# EasyEDA Pro project JLCEDA_AT-START-F490 V1.0.epro, board AT-START-F490 V1.0
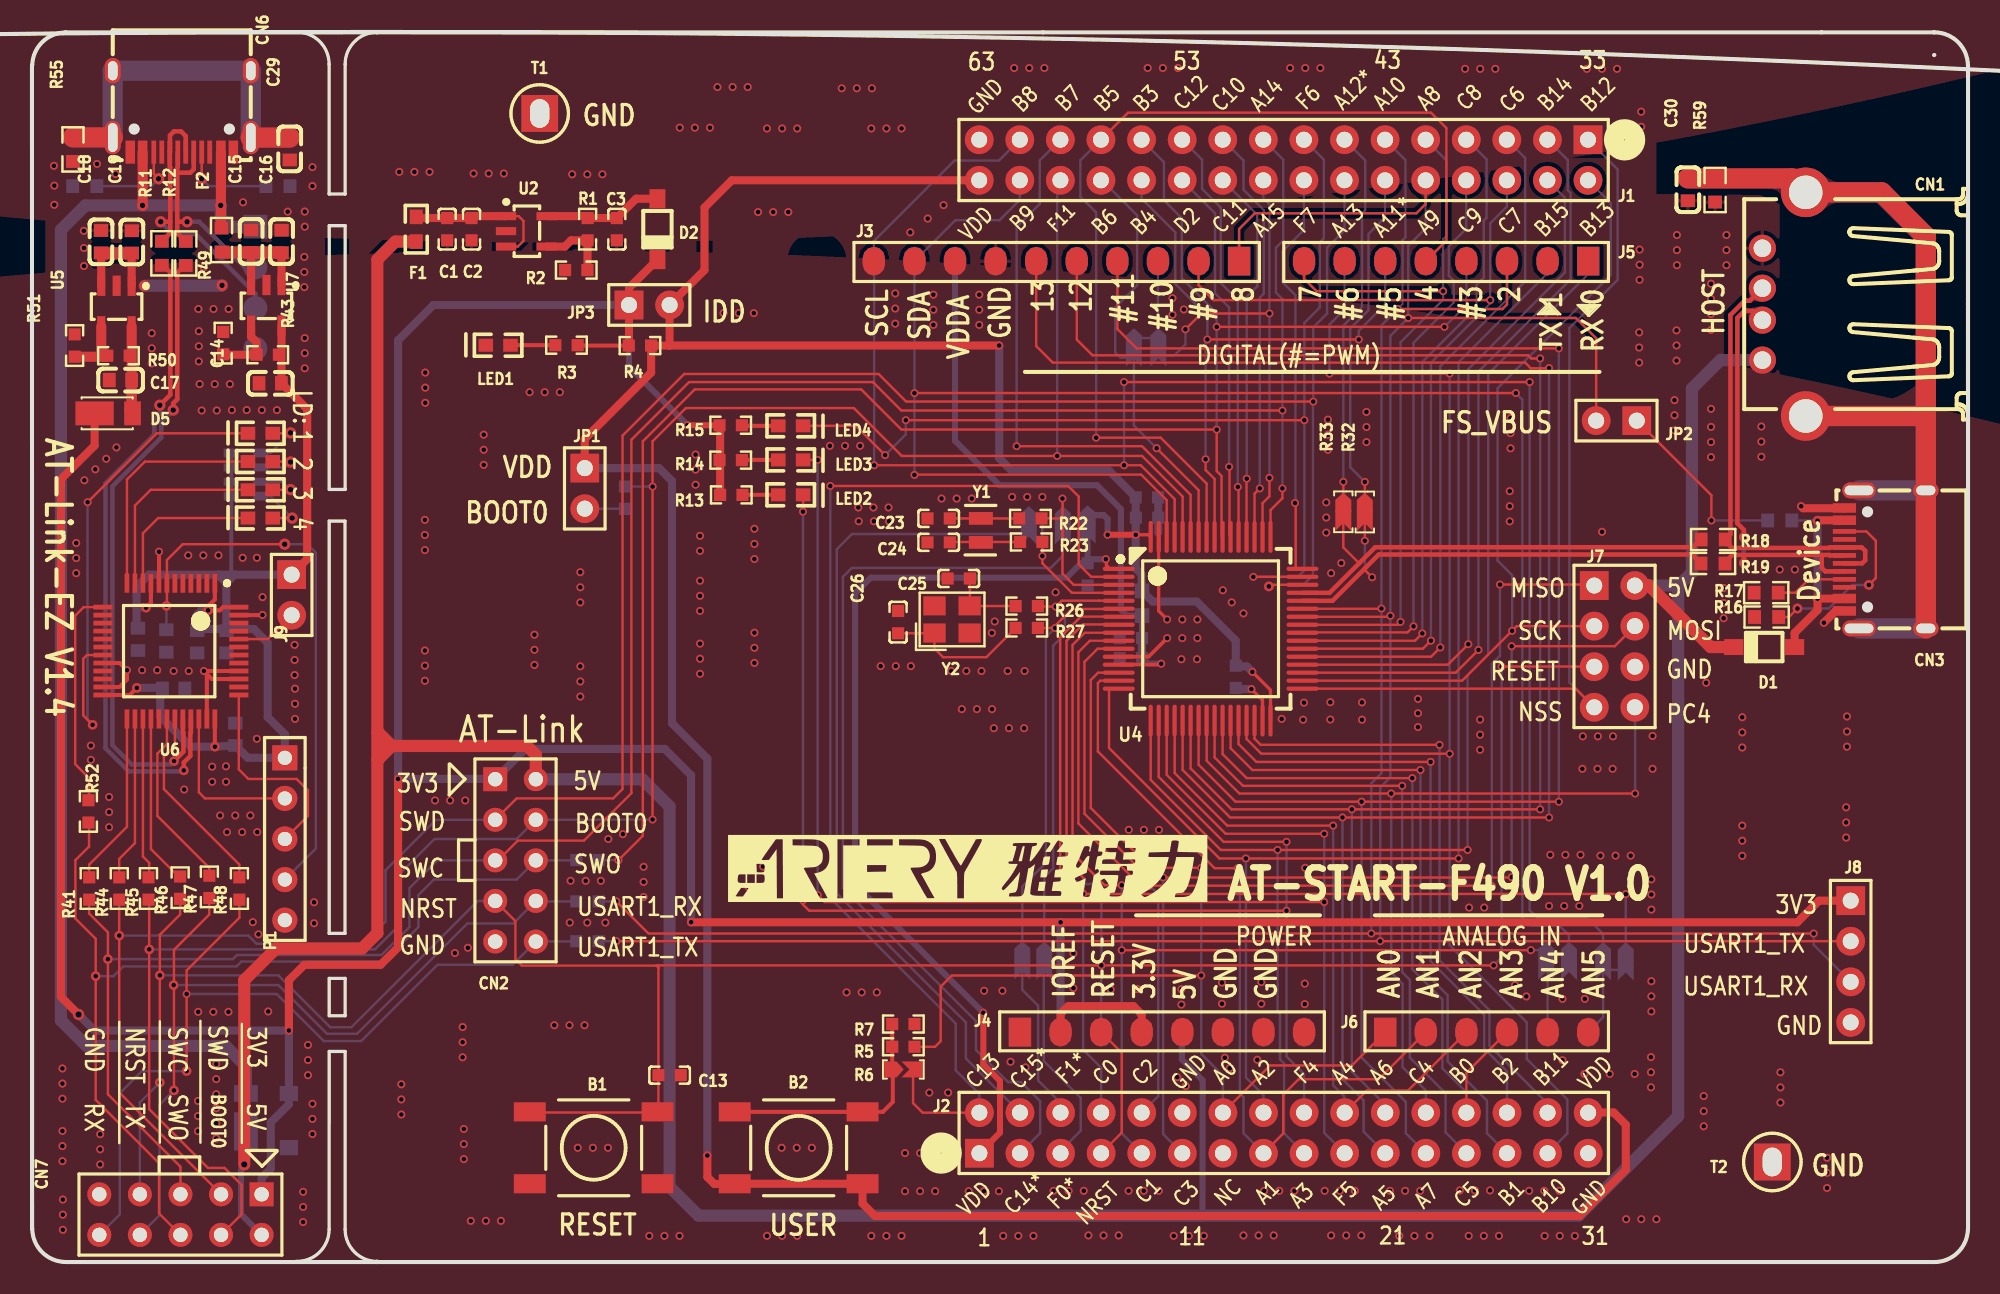
[diagram p4: board, top side]
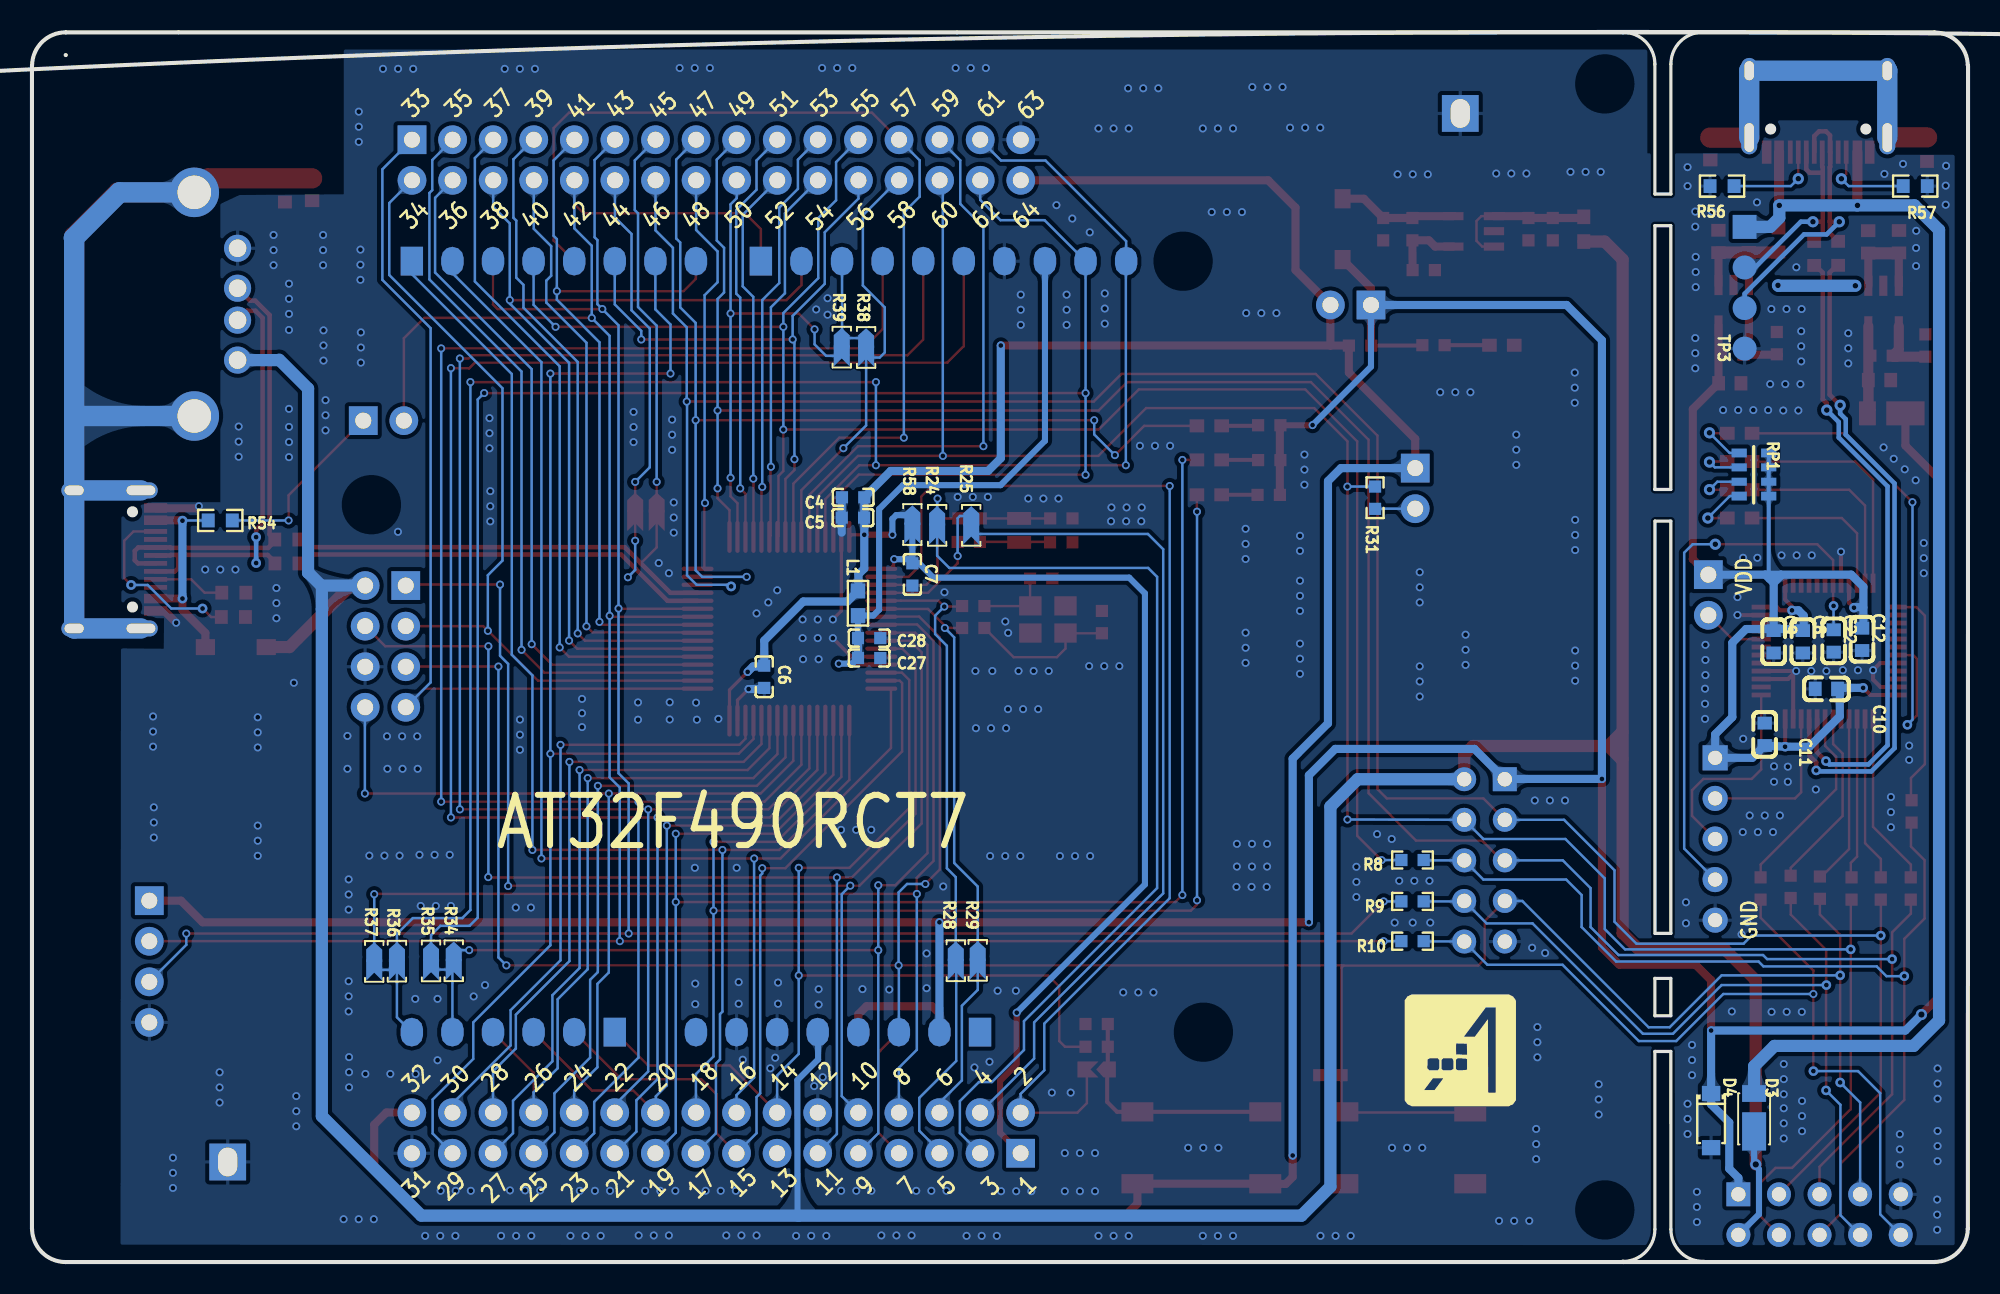
[diagram p5: board, bottom side, seen from below]

Outline 121.17 x 77 mm; copper layers: Top Layer, Bottom Layer. Coordinates in mm from the lower left corner of the outline.
Outline path: 16.6,76.99 arc(18.01,76.4) 18.6,74.99 18.6,66.85 19.6,66.85 19.6,74.98 arc(20.19,76.39) 21.6,76.98 ; 16.52,0.04 arc(17.98,0.6) 18.6,2.04 18.6,13.18 19.6,13.18 19.6,2.04 arc(20.19,0.63) 21.6,0.03 arc(21.59,0.03) 21.58,0.03 ; 119.04,75.55 arc(119.05,75.55) 119.06,75.55 ; 0,74.87 0.01,2.11 arc(0.01,2.09) 0.02,2.07 arc(0.63,0.62) 2.09,0.01 arc(2.1,0) 2.12,0 21.57,0 arc(21.58,0) 21.58,0 21.6,0 104.94,0 119.06,0 arc(120.53,0.6) 121.16,2.07 arc(121.17,2.08) 121.17,2.1 121.17,2.1 121.17,74.87 arc(121.17,74.89) 121.16,74.91 arc(120.53,76.37) 119.06,76.97 119.04,76.97 2.12,76.97 arc(2.1,76.97) 2.08,76.97 arc(0.64,76.36) 0.02,74.93 arc(0,74.9) 0,74.87 ; 18.6,17.76 18.6,15.42 19.6,15.42 19.6,17.76 18.6,17.76 ; 18.6,20.57 19.59,20.57 19.59,46.38 18.6,46.38 18.6,20.57 ; 18.6,64.87 18.6,48.36 19.59,48.36 19.6,48.37 19.6,64.87 18.6,64.87
Stack: Top Layer 0.035mm / Dielectric1 1.51mm FR4 er 4.5 / Bottom Layer 0.035mm

## Design rules (mm)
net M-USB_D+: LK
net M-USB_D-: LK
net USB-: LKD
net USB+: LKD
net PA12: DP1
net PA11: DP1
net FD-: FS
net FD+: FS
spacing Default (default): track to track 0.152, other pairs 0.127 to 0.3
track width Default (default): min 0.15, default 0.15, max 25.4
differential pair differentialPair (default): width min 0.152, default 0.282, max 2.54; gap min 0.152, default 0.152
via Default (default): diameter min 0.5, default 0.5, max 10; hole min 0.201, default 0.305, max 5.999
net GND uses gge24930(1)

## Placement (name value [footprint] x y rotation side)
B1  BUTTON_SMT,6.0x6.0x4.5mm  [BUTTON_SMT_6*6*5]  35.16 7.15 0 top
B2  BUTTON_SMT,6.0x6.0x4.5mm  [BUTTON_SMT_6*6*5]  47.98 7.15 180 top
C1  10uF  [0603_C-M]  25.99 64.65 90 top
C2  0.1uF  [0603_C-M]  27.51 64.65 90 top
C3  10uF  [0603_C-M]  36.6 64.65 90 top
C4  4.7uF  [0603_C-M]  69.78 47.87 180 bottom
C5  0.1uF  [0603_C-M]  69.79 46.6 180 bottom
C6  0.1uF  [0603_C-M]  75.34 36.64 90 bottom
C7  0.1uF  [0603_C-M]  66.07 43.04 90 bottom
C8  4.7uF  [C0603]  10.34 38.83 270 bottom
C9  100nF  [C0603]  12.17 38.83 270 bottom
C10  100nF  [C0603]  8.87 35.88 0 bottom
C11  100nF  [C0603]  12.73 33.03 90 bottom
C12  100nF  [C0603]  6.63 38.98 270 bottom
C13  0.1uF  [0603_C-M]  39.91 11.7 0 top
C14  10uF  [C0603]  14.91 55.01 180 top
C15  10uF  [C0603]  13.72 63.9 90 top
C16  100nF  [C0603]  15.62 63.88 90 top
C17  10uF  [C0603]  5.54 55.21 180 top
C18  10uF  [C0603]  4.32 63.87 90 top
C19  100nF  [C0603]  6.25 63.86 90 top
C22  100nF  [C0603]  8.41 38.88 270 bottom
C23  18pF  [0603_C-M]  56.75 46.55 180 top
C24  18pF  [0603_C-M]  56.75 45.05 180 top
C25  15pF  [0603_C-M]  58 42.79 180 top
C26  15pF  [0603_C-M]  54.21 40.06 90 top
C27  1uF  [0603_C-M]  68.77 37.81 180 bottom
C28  0.1uF  [0603_C-M]  68.77 39.05 180 bottom
C29  100nF  [C0603]  16.13 69.69 90 top
C30  100nF  [C0603]  103.63 67.13 90 top
CN1  USB type A  [USB-A-TH__USB-AF-90]  109.65 59.96 90 top
CN2  NC(Header 2x5)  [HDR2X5#2]  28.99 30.22 270 top
CN3  -  [USB-C-SMD_TYPEC-304-BCP16]  115.98 43.98 90 top
CN6  -  [USB-C-SMD_TYPEC-304-BCP16]  9.38 72.02 180 top
CN7  CON1  [HDR2X5]  14.37 4.24 180 top
D1  DFLS130L-7  [SOD-123]  108.41 38.5 0 top
D2  DFLS130L-7  [SOD-123]  39.14 64.65 90 top
D3  DFLS130L-7  [POWERDI-123_L2.8-W1.8-LS3.7-RD]  13.39 9.36 90 bottom
D4  SMF3.3A  [SOD-123_L2.8-W1.8-LS3.7-RD]  16.08 8.85 270 bottom
D5  DFLS130L-7  [POWERDI-123_L2.8-W1.8-LS3.7-RD]  5.11 53.13 0 top
F1  SMD0603B050TF  [R0603#2]  24.06 63.88 90 top
F2  SMD0603B050TF  [R0603]  11.86 63.97 270 top
J1  Header 2x16  [HDR-M-2.54_2X16]  78.33 68.98 180 top
J2  Header 2x16  [HDR-M-2.54_2X16]  78.34 8.08 0 top
J3  CON10  [FEMALE HEADER 1X10]  75.55 62.65 180 top
J4  CON8  [FEMALE HEADER 1X8]  61.83 14.39 0 top
J5  CON8  [FEMALE HEADER 1X8]  97.39 62.65 180 top
J6  CON6  [FEMALE HEADER 1X6]  84.69 14.39 0 top
J7  Header 4X2  [HDR2X4]  97.77 42.35 270 top
J8  Header 1x4  [HDR1X4]  113.82 22.62 270 top
J9  1X2P,Male,DIP_2.54  [HDR1X2]  16.25 43.03 270 top
JP1  NC(Header 1x2)  [HEADER 1X2]  34.6 49.7 270 top
JP2  NC(Header 1x2)  [HEADER 1X2]  100.43 52.67 180 top
JP3  NC(Header 1x2)  [HEADER 1X2]  37.37 59.91 0 top
L1  0.5A,600R@100Mhz  [0603_L]  69.47 41.24 270 bottom
LD1  RED  [LED0603]  15.06 46.58 180 top
LD2  GREEN  [LED0603]  15.06 48.35 180 top
LD3  BLUE  [LED0603]  15.06 50.11 180 top
LD4  YELLOW  [LED0603]  15.06 51.88 180 top
LED1  RED  [LED0603]  29.95 57.39 180 top
LED2  RED  [LED0603]  46.71 48.02 0 top
LED3  YELLOW  [LED0603]  46.71 50.21 0 top
LED4  GREEN  [LED0603]  46.71 52.34 0 top
P1  HDR-M-2.54_1x5  [HDR-M-2.54_1X5]  15.83 26.48 270 top
R1  51k  [0603_R-M]  34.78 64.65 270 top
R2  15k  [0603_R-M]  34.06 62.09 180 top
R3  1K  [0603_R-M]  33.45 57.39 0 top
R4  0R  [0603_R-M]  38.05 57.37 0 top
R5  0R  [0603_R-M]  54.54 13.48 0 top
R6  NC  [SB-PAD]  54.54 12.05 0 top
R7  100K  [0603_R-M]  54.54 14.9 180 top
R8  470R  [0603_R-M]  34.77 25.17 0 bottom
R9  470R  [0603_R-M]  34.77 22.58 0 bottom
R10  470R  [0603_R-M]  34.77 20.09 0 bottom
R11  0Ω  [R0603]  8.13 63.14 270 top
R12  0Ω  [R0603]  9.63 63.13 270 top
R13  1K  [0603_R-M]  43.77 48.02 0 top
R14  1K  [0603_R-M]  43.73 50.2 0 top
R15  1K  [0603_R-M]  43.73 52.38 0 top
R16  5.1kΩ  [R0603]  108.56 40.38 180 top
R17  5.1kΩ  [R0603]  108.54 41.9 180 top
R18  0Ω  [R0603]  105.22 45.23 0 top
R19  0Ω  [R0603]  105.21 43.73 0 top
R22  0R  [0603_R-M]  62.49 46.55 0 top
R23  0R  [0603_R-M]  62.54 45.07 0 top
R24  NC  [SB-PAD]  64.52 46.12 270 bottom
R25  NC  [SB-PAD]  62.38 46.12 270 bottom
R26  0R  [0603_R-M]  62.26 41.06 0 top
R27  0R  [0603_R-M]  62.26 39.69 0 top
R28  NC  [SB-PAD]  63.35 18.86 270 bottom
R29  NC  [SB-PAD]  61.98 18.89 270 bottom
R31  10K  [0603_R-M]  37.11 47.84 270 bottom
R32  NC  [SB-PAD]  83.42 46.95 270 top
R33  NC  [SB-PAD]  82.07 46.96 270 top
R34  0R  [SB-PAD]  94.77 18.86 270 bottom
R35  NC  [SB-PAD]  96.19 18.85 270 bottom
R36  NC  [SB-PAD]  98.33 18.83 270 bottom
R37  0R  [SB-PAD]  99.75 18.82 270 bottom
R38  NC  [SB-PAD]  68.96 57.25 270 bottom
R39  0R  [SB-PAD]  70.49 57.27 270 bottom
R41  33R  [0603_R-M]  3.58 23.38 270 top
R43  47K  [0603_R-M]  14.76 56.8 180 top
R44  33R  [0603_R-M]  5.46 23.38 270 top
R45  33R  [0603_R-M]  7.29 23.38 270 top
R46  33R  [0603_R-M]  9.27 23.43 270 top
R47  33R  [0603_R-M]  11.1 23.48 270 top
R48  33R  [0603_R-M]  12.98 23.38 270 top
R49  15K  [0603_R-M]  11.97 57.52 270 top
R50  51K  [0603_R-M]  5.41 56.73 180 top
R51  15K  [0603_R-M]  2.67 57.37 270 top
R52  33R  [0603_R-M]  3.53 28.21 270 top
R54  10kΩ  [R0603]  109.38 46.42 0 bottom
R55  1MΩ  [R0603]  2.57 69.64 270 top
R56  5.1kΩ  [R0603]  15.39 67.35 0 bottom
R57  5.1kΩ  [R0603]  3.3 67.35 180 bottom
R58  0R  [SB-PAD]  66.07 46.17 270 bottom
R59  1MΩ  [R0603]  105.34 67.1 270 top
RP1  1K  [0603*4,8P4R]  12.47 47.94 90 bottom
T1  Testpoint  [TESTHOOK]  31.78 71.9 270 top
T2  Testpoint  [TESTHOOK]  108.92 6.26 90 top
TP3  1X4P_2.54F  [HDR1X4 - TOP]  13.98 64.8 90 bottom
U2  RT9080N-08GJ5  [SOT-23-5]  31.32 62.93 0 top
U4  -  [lqfp-64_l10.0-w10.0-p0.50-ls12.0-bl]  73.76 39.64 270 top
U5  RT9080N-08GJ5  [SOT-23-5]  3.7 59.46 270 top
U6  AT32F403CGT6  [LQFP48 - 2]  11.45 42.5 270 top
U7  RT9080N-08GJ5  [SOT-23-5]  13.08 59.51 270 top
Y1  32.768KHz  [XTAL_SOP - FC-12M]  59.39 46.55 270 top
Y2  12MHz  [CRYSTAL-SMD_4P-L3.2-W2.5-BL]  57.58 40.22 0 top

## Footprints (pads in the part's own frame, mm; a bottom-side part is the same pattern mirrored in y, then rotated)
0603*4,8P4R
  rect 0.55x0.95 smd: 1(0,0) 4(2.7,0) 5(2.7,1.85) 8(0,1.85)
  rect 0.5x0.95 smd: 2(0.9,0) 3(1.8,0) 6(1.8,1.85) 7(0.9,1.85)
0603_C-M
  rect 0.762x0.762 smd: 1(0.699,0) 2(-0.699,0)
0603_L
  rect 0.93x0.9 smd: 1(-0.77,0) 2(0.77,0)
0603_R-M
  rect 0.762x0.762 smd: 1(0.699,0) 2(-0.699,0)
BUTTON_SMT_6*6*5
  rect 2x1.2 smd: 1(-4,2.25) 2(4,2.25) 3(-4,-2.25) 4(4,-2.25)
C0603
  rect 0.8x0.9 smd: 1(-0.7,0) 2(0.7,0)
CRYSTAL-SMD_4P-L3.2-W2.5-BL
  rect 1.4x1.2 smd: 1(-1.1,-0.85) 2(1.1,-0.85) 3(1.1,0.85) 4(-1.1,0.85)
FEMALE HEADER 1X6
  custom 1.4x1.8 hole 0.7x1: 1(0,0) 2(2.54,0) 3(5.08,0) 4(7.62,0) 5(10.16,0) 6(12.7,0)
FEMALE HEADER 1X8
  custom 1.4x1.8 hole 0.7x1: 1(0,0) 2(2.54,0) 3(5.08,0) 4(7.62,0) 5(10.16,0) 6(12.7,0) 7(15.24,0) 8(17.78,0)
FEMALE HEADER 1X10
  custom 1.4x1.8 hole 0.7x1: 1(0,0) 2(2.54,0) 3(5.08,0) 4(7.62,0) 5(10.16,0) 6(12.7,0) 7(15.24,0) 8(17.78,0) 9(20.32,0) 10(22.86,0)
HDR1X2
  rect 1.8x1.8 hole 1.005x1: 1(0,0)
  round 1.8 hole 1.005x1: 2(2.54,0)
HDR1X4
  rect 1.8x1.8 hole 1: 1(0,0)
  round 1.8 hole 1: 2(2.54,0) 3(5.08,0) 4(7.62,0)
HDR1X4 - TOP
  rect 1.5x1.5 smd: 1(0,0)
  round 1.5 smd: 2(-2.54,0) 3(-5.08,0) 4(-7.62,0)
HDR2X4
  rect 1.8x1.8 hole 1: 1(0,0)
  round 1.8 hole 1: 2(0,2.54) 3(2.54,0) 4(2.54,2.54) 5(5.08,0) 6(5.08,2.54) 7(7.62,0) 8(7.62,2.54)
HDR2X5
  rect 1.5x1.5 hole 0.9: 1(0,0)
  round 1.5 hole 0.9: 2(0,2.54) 3(2.54,0) 4(2.54,2.54) 5(5.08,0) 6(5.08,2.54) 7(7.62,0) 8(7.62,2.54) 9(10.16,0) 10(10.16,2.54)
HDR2X5#2
  rect 1.5x1.5 hole 0.905x0.9: 1(0,0)
  round 1.5 hole 0.905x0.9: 2(0,2.54) 3(2.54,0) 4(2.54,2.54) 5(5.08,0) 6(5.08,2.54) 7(7.62,0) 8(7.62,2.54) 9(10.16,0) 10(10.16,2.54)
HDR-M-2.54_1X5
  rect 1.575x1.575 hole 0.889: 1(-5.08,0)
  round 1.575 hole 0.889: 2(-2.54,0) 3(0,0) 4(2.54,0) 5(5.08,0)
HDR-M-2.54_2X16
  rect 1.8x1.8 hole 1: 1(-19.05,-1.27)
  round 1.8 hole 1: 2(-19.05,1.27) 3(-16.51,-1.27) 4(-16.51,1.27) 5(-13.97,-1.27) 6(-13.97,1.27) 7(-11.43,-1.27) 8(-11.43,1.27) 9(-8.89,-1.27) 10(-8.89,1.27) 11(-6.35,-1.27) 12(-6.35,1.27) 13(-3.81,-1.27) 14(-3.81,1.27) 15(-1.27,-1.27) 16(-1.27,1.27) 17(1.27,-1.27) 18(1.27,1.27) 19(3.81,-1.27) 20(3.81,1.27) 21(6.35,-1.27) 22(6.35,1.27) 23(8.89,-1.27) 24(8.89,1.27) 25(11.43,-1.27) 26(11.43,1.27) 27(13.97,-1.27) 28(13.97,1.27) 29(16.51,-1.27) 30(16.51,1.27) 31(19.05,-1.27) 32(19.05,1.27)
HEADER 1X2
  rect 1.8x1.8 hole 1.005x1: 1(0,-0.001)
  round 1.8 hole 1.005x1: 2(2.54,0)
LED0603
  rect 0.914x0.813 smd: 1(-0.001,0.005) 2(1.548,0.005)
LQFP48 - 2
  rect 1.2x0.3 smd: 1(0,0) 2(0,-0.5) 3(0,-1) 4(0,-1.5) 5(0,-2) 6(0,-2.5) 7(0,-3) 8(0,-3.5) 9(0,-4) 10(0,-4.5) 11(0,-5) 12(0,-5.5) 25(8.5,-5.5) 26(8.5,-5) 27(8.5,-4.5) 28(8.5,-4) 29(8.5,-3.5) 30(8.5,-3) 31(8.5,-2.5) 32(8.5,-2) 33(8.5,-1.5) 34(8.5,-1) 35(8.5,-0.5) 36(8.5,0)
  rect 0.3x1.2 smd: 13(1.5,-7) 14(2,-7) 15(2.5,-7) 16(3,-7) 17(3.5,-7) 18(4,-7) 19(4.5,-7) 20(5,-7) 21(5.5,-7) 22(6,-7) 23(6.5,-7) 24(7,-7) 37(7,1.5) 38(6.5,1.5) 39(6,1.5) 40(5.5,1.5) 41(5,1.5) 42(4.5,1.5) 43(4,1.5) 44(3.5,1.5) 45(3,1.5) 46(2.5,1.5) 47(2,1.5) 48(1.5,1.5)
lqfp-64_l10.0-w10.0-p0.50-ls12.0-bl
  oval 0.268x2 smd: 1(-3.75,-5.75) 2(-3.25,-5.75) 3(-2.75,-5.75) 4(-2.25,-5.75) 5(-1.75,-5.75) 6(-1.25,-5.75) 7(-0.75,-5.75) 8(-0.25,-5.75) 9(0.25,-5.75) 10(0.75,-5.75) 11(1.25,-5.75) 12(1.75,-5.75) 13(2.25,-5.75) 14(2.75,-5.75) 15(3.25,-5.75) 16(3.75,-5.75) 33(3.75,5.75) 34(3.25,5.75) 35(2.75,5.75) 36(2.25,5.75) 37(1.75,5.75) 38(1.25,5.75) 39(0.75,5.75) 40(0.25,5.75) 41(-0.25,5.75) 42(-0.75,5.75) 43(-1.25,5.75) 44(-1.75,5.75) 45(-2.25,5.75) 46(-2.75,5.75) 47(-3.25,5.75) 48(-3.75,5.75)
  oval 2x0.268 smd: 17(5.75,-3.75) 18(5.75,-3.25) 19(5.75,-2.75) 20(5.75,-2.25) 21(5.75,-1.75) 22(5.75,-1.25) 23(5.75,-0.75) 24(5.75,-0.25) 25(5.75,0.25) 26(5.75,0.75) 27(5.75,1.25) 28(5.75,1.75) 29(5.75,2.25) 30(5.75,2.75) 31(5.75,3.25) 32(5.75,3.75) 49(-5.75,3.75) 50(-5.75,3.25) 51(-5.75,2.75) 52(-5.75,2.25) 53(-5.75,1.75) 54(-5.75,1.25) 55(-5.75,0.75) 56(-5.75,0.25) 57(-5.75,-0.25) 58(-5.75,-0.75) 59(-5.75,-1.25) 60(-5.75,-1.75) 61(-5.75,-2.25) 62(-5.75,-2.75) 63(-5.75,-3.25) 64(-5.75,-3.75)
POWERDI-123_L2.8-W1.8-LS3.7-RD
  rect 2.4x1.5 smd: 1(-1.188,0)
  rect 1.05x1.5 smd: 2(1.188,0)
R0603
  rect 0.806x0.864 smd: 1(-0.753,0) 2(0.753,0)
R0603#2
  rect 0.914x0.813 smd: 1(-0.001,0.005) 2(1.548,0.005)
SB-PAD
  custom 1.226x1 smd: 1(-0.587,0)
  custom 1.319x1 smd: 2(0.54,0)
SOD-123
  rect 1.2x1 smd: 1(1.905,0) 2(-1.905,0)
SOD-123_L2.8-W1.8-LS3.7-RD
  rect 0.95x1.15 smd: 1(-1.692,0) 2(1.692,0)
SOT-23-5
  rect 1.27x0.508 smd: 1(-1.651,2.54) 2(-1.651,1.6) 3(-1.651,0.635) 4(0.889,0.635) 5(0.889,2.54)
TESTHOOK
  rect 2.3x2.3 hole 1.8x1.2: 1(0,0)
USB-A-TH__USB-AF-90
  round 1.7 hole 1.1: 1(-3.5,1.355) 2(-1,1.355) 3(1,1.355) 4(3.5,1.355)
  round 3.1 hole 2.1: SH1(7,-1.355) SH2(-7,-1.355)
USB-C-SMD_TYPEC-304-BCP16
  oval 1.001x2.1 hole 0.6x1.801: 13(-4.321,1.633) 14(4.321,1.633)
  oval 1.001x1.6 hole 0.6x1.199: 15(-4.321,-2.547) 16(4.321,-2.547)
  rect 0.6x1.45 smd: A1B12(-3.226,2.547) A4B9(-2.451,2.547) B1A12(3.22,2.547) B4A9(2.451,2.547)
  rect 0.299x1.45 smd: A5(-1.25,2.547) A6(-0.249,2.547) A7(0.249,2.547) A8(1.25,2.547) B5(1.75,2.547) B6(0.75,2.547) B7(-0.75,2.547) B8(-1.75,2.547)
XTAL_SOP - FC-12M
  rect 0.8x1.5 smd: 1(0,0) 2(1.5,0)

## Nets
As in the schematic, except:
VDD: B2.1 B2.2 C4.1 C5.1 C6.1 C7.1 J1.32 J2.1 J2.32 JP1.1 JP3.2 L1.1 R4.1 R58.1 R58.2 U4.1 U4.32 U4.64

Pads without a net: CN3 A8 B8; CN6 A8 B8; J2 13; J4 1 8; U6 2 3 4 5 6 14 15 16 17 18 21 22 29 38 41 42 43 45 46

## Via types
v1: diameter 0.5, hole 0.3, Top Layer to Bottom Layer, 674 vias
v2: diameter 0.7, hole 0.4, Top Layer to Bottom Layer, 2 vias
v3: diameter 0.6, hole 0.3, Top Layer to Bottom Layer, 17 vias
v4: diameter 0.61, hole 0.305, Top Layer to Bottom Layer, 7 vias
v5: diameter 0.7, hole 0.35, Top Layer to Bottom Layer, 15 vias

## Routing (per net, layer and track width the routed paths; a pad name or vN(x,y) marks a point on that pad's centre or on a via; arc(x,y) is an arc through that point)
3V3: length 269.2
  Top Layer w0.254: R3.1 34.18,57.37 R4.2
  Top Layer w0.381: v1(41.02,52.39) 41.03,52.38 R15.2
  Top Layer w0.508: v2(2.92,15.49) 1.82,16.6 1.82,49 3.92,51.11 D5.1 ; R4.2 37.37,57.38 37.37,60.97 D2.2 ; R13.2 43.07,52.35 R15.2 ; J4.4 69.45,15.5 68.94,16.02 64.85,16.02 64.37,15.54 J4.2 ; v1(41.25,21.27) 41.26,21.27 v1(64.37,21.27) 110.49,21.27 111.84,22.62 J8.1 ; v1(22.91,30.24) 22.91,19.7 21.82,18.61 17.05,18.61 16.08,17.64 v1(16.08,14.49)
  Bottom Layer w0.381: 37.37,59.91 37.37,56.05 v1(41.02,52.39) ; v1(64.37,21.27) 64.37,21.27
  Bottom Layer w0.508: J4.2 v1(64.37,21.27) ; 37.37,59.91 25.12,59.91 22.91,57.7 v1(22.91,30.24) 28.97,30.24 CN2.1 30.89,32.12 39.6,32.12 41.25,30.47 v1(41.25,21.27) ; v2(2.92,15.49) 3.92,14.49 v1(16.08,14.49) D4.1 16.08,9.87 14.95,8.74 14.95,5.84 14.37,5.27 14.37,4.24
5V: length 259.7
  Top Layer w0.762: 22.52,32.3 21.67,33.16 21.62,33.16 ; 22.52,32.3 21.69,31.47 21.62,31.47 ; 22.52,32.3 30.98,32.3 31.53,31.76 CN2.2 ; D1.2 105.06,38.5 101.21,42.35 J7.2 ; F1.1 22.74,63.88 21.62,62.75 21.62,20.59 20.65,19.62 15.27,19.62 13.29,17.64 v2(13.29,6.11)
  Bottom Layer w0.381: D3.1 13.39,6.11 13.08,5.81 13.08,2.99 14.37,1.7 ; 73.22,2.91 73.22,2.81 ; 71.97,14.39 71.97,12.68 73.27,11.38 73.26,2.97 73.19,2.91
  Bottom Layer w0.762: 105.7,56.48 103.89,54.68 103.89,43.17 ; 103.89,43.14 103.89,43.17 ; 103.89,43.17 103.03,42.3 ; J7.2 102.99,42.35 ; CN2.2 38.2,30.22 39.91,28.51 39.91,4.72 41.72,2.91 96.8,2.91 103.03,9.13 103.03,40.86 ; 105.7,56.46 CN1.1 ; 103.03,42.3 103.03,42.31 ; 103.03,42.3 103.03,40.86 ; 103.03,42.3 102.99,42.27 ; 102.99,40.9 103.03,40.86
GND: length 33.6
  Top Layer w0.203: v1(76.32,35.87) 77.01,35.17 U4.31 ; v1(71.05,40.22) 70.51,40.76 U4.63
  Top Layer w0.229: U4.12 69.88,37.89 v1(71.05,39.05)
  Top Layer w0.254: 10.95,36.81 v1(10.76,37) 12.94,37 U6.40 ; 10.95,36.81 11.26,36.5 U6.39 ; 10.95,36.81 U6.35 ; v1(7.95,44.46) 7.95,42.5 U6.8 ; U6.47 14.42,40.5 v1(14.43,40.5) ; U6.20 5.5,37.5 v1(5.95,37.05) 5.95,36.46 5.48,35.99 U6.23
  Top Layer w0.508: CN3.A1B12 112.88,40.76 v1(112.14,40.02) ; CN3.B1A12 113.41,47.18 110.85,47.18 v1(110.72,47.31)
  Bottom Layer w0.508: C4.2 70.49,47.86 C5.2 70.49,45.66 ; v1(76.32,35.87) 75.41,35.87 C6.2
  vias: v1(1.37,68.62) v1(1.4,67.38) v1(1.4,66.18) v1(1.91,12.12) v1(1.91,11.17) v1(1.91,10.23) v1(1.91,8.21) v1(1.91,7.26) v1(1.91,6.31) v1(1.93,3.91) v1(1.93,2.97) v1(1.93,2.02) v1(2.77,45.01) v1(2.77,44.06) v1(2.77,43.12) v1(3.24,64.55) v1(3.25,63.48) v1(3.25,62.35) v1(3.28,48.94) v1(3.69,32.33) v1(3.69,31.43) v1(3.97,49.62) v1(4.07,68.74) v1(4.27,8) v1(4.27,7.06) v1(4.27,6.11) v1(4.65,50.28) v1(4.83,29.11) v1(4.83,28.16) v1(4.83,27.22) v1(5.23,68.11) v1(5.29,50.99) v1(6.89,37.05) v1(7.5,58.14) v1(7.5,57.2) v1(7.5,56.25) v1(7.84,37.05) v1(8.87,37) v1(9.53,29.58) v1(9.78,44.24) v1(9.81,37) v1(10.42,59.65) v1(10.44,58.27) v1(10.44,57.32) v1(10.44,56.38) v1(10.4,15.66) v1(10.39,10.09) v1(10.39,9.14) v1(10.39,8.19) v1(10.49,54.96) v1(10.62,53.3) v1(10.75,62.27) v1(10.73,44.24) v1(11.36,59.65) v1(11.28,31.01) v1(11.28,30.06) v1(11.35,15.66) v1(11.44,54.96) v1(11.57,53.3) v1(11.53,12.4) v1(11.53,11.45) v1(11.53,10.5) v1(11.53,9.63) v1(11.53,8.68) v1(11.53,7.74) v1(11.67,44.24) v1(11.78,27.95) v1(12.14,31.03) v1(12.14,30.06) v1(12.21,26.91) v1(12.31,59.65) v1(12.3,15.66) v1(12.38,54.96) v1(12.51,53.33) v1(12.72,27.95) v1(13.15,26.91) v1(13.21,66.33) v1(13.19,44.08) v1(13.44,53.33) v1(13.67,27.95) v1(13.82,21.27) v1(14.08,44.08) v1(14.07,32.76) v1(14.1,26.91) v1(14.18,20.51) v1(14.38,53.33) v1(14.43,41.62) v1(14.78,15.69) v1(15.33,53.33) v1(16,65.75) v1(16.44,38.63) v1(16.44,37.69) v1(16.44,36.74) v1(16.46,35.89) v1(16.46,34.95) v1(16.46,34) v1(17.05,62.92) v1(17.05,61.97) v1(17.05,61.03) v1(16.97,4.4) v1(16.97,3.45) v1(16.97,2.5) v1(17.07,65.76) v1(17.07,64.81) v1(17.07,57.84) v1(17.07,56.89) v1(17.07,55.95) v1(17.27,13.59) v1(17.27,12.64) v1(17.27,11.7) v1(17.55,68.54) v1(17.55,67.35) v1(17.55,9.91) v1(17.55,8.96) v1(17.55,8.02) v1(17.66,22.52) v1(17.66,21.21) v1(22.99,68.24) v1(23.12,11.13) v1(23.12,10.18) v1(23.12,9.24) v1(23.94,68.24) v1(24.61,55.68) v1(24.61,54.73) v1(24.61,53.79) v1(24.59,46.46) v1(24.59,45.51) v1(24.59,44.57) v1(24.59,38.28) v1(24.59,37.33) v1(24.59,36.39) v1(24.88,68.24) v1(25.22,28.89) v1(26.17,28.89) v1(26.47,19.34) v1(26.95,14.71) v1(26.95,13.76) v1(26.95,12.82) v1(27.03,8.33) v1(27.03,7.39) v1(27.03,6.44) v1(27.12,28.89) v1(27.28,19.67) v1(27.46,2.58) v1(27.64,68.14) v1(28.27,51.79) v1(28.27,50.85) v1(28.27,49.9) v1(28.41,2.58) v1(28.58,68.14) v1(29.35,2.58) v1(29.53,68.14) v1(31.14,54.45) v1(31.45,39.27) v1(31.45,38.32) v1(31.45,37.38) v1(32.09,54.45) v1(32.69,14.82) v1(33.03,54.45) v1(33.66,21.25) v1(33.64,14.82) v1(33.71,23.87) v1(33.81,68.09) v1(34.16,7.15) v1(34.32,43.18) v1(34.32,42.24) v1(34.32,41.29) v1(34.32,37.29) v1(34.32,36.34) v1(34.32,35.4) v1(34.65,23.87) v1(34.58,14.82) v1(34.76,68.09) v1(34.76,21.25) v1(35.1,7.15) v1(35.6,23.87) v1(35.7,68.09) v1(35.89,21.25) v1(36.05,7.15) v1(36.07,26.48) v1(36.98,26.79) v1(38.28,24.74) v1(38.28,23.8) v1(38.28,22.85) v1(38.64,1.64) v1(39.58,1.64) v1(40.54,71.01) v1(40.53,1.64) v1(41.49,71.01) v1(41.53,50.55) v1(41.53,49.6) v1(41.53,48.66) v1(41.81,45.46) v1(41.81,44.52) v1(41.81,42.65) v1(41.81,41.7) v1(41.81,40.76) v1(41.81,38.71) v1(41.81,37.77) v1(41.81,36.82) v1(42.43,71.01) v1(42.9,73.55) v1(43.28,59.4) v1(43.85,73.55) v1(43.87,26.18) v1(43.87,24.75) v1(43.89,23.48) v1(44.23,59.4) v1(44.79,73.55) v1(44.81,26.18) v1(44.81,24.75) v1(44.84,23.48) v1(45.18,59.4) v1(45.21,45.9) v1(45.21,44.95) v1(45.21,44.01) v1(45.21,39.4) v1(45.21,38.45) v1(45.21,37.51) v1(45.44,65.72) v1(45.76,26.18) v1(45.76,24.75) v1(45.78,23.48) v1(46,70.96) v1(46,1.64) v1(46.39,65.72) v1(46.95,70.96) v1(46.92,7.15) v1(46.95,1.64) v1(47.33,65.72) v1(47.86,7.15) v1(47.89,70.96) v1(47.89,1.64) v1(48.81,7.15) v1(49.94,51.09) v1(50.68,73.47) v1(50.88,51.09) v1(50.98,16.88) v1(51.62,73.47) v1(51.72,47.23) v1(51.74,46.37) v1(51.83,51.09) v1(51.93,16.88) v1(52.53,70.96) v1(52.53,1.64) v1(52.57,73.47) v1(52.66,47.23) v1(52.69,46.37) v1(52.87,16.88) v1(53.11,37.3) v1(53.48,70.96) v1(53.48,1.64) v1(53.61,47.23) v1(53.63,46.37) v1(54.03,60.63) v1(54.03,59.69) v1(54.03,58.74) v1(54.06,37.3) v1(54.42,70.96) v1(54.42,1.64) v1(54.64,6.82) v1(54.64,4.43) v1(54.94,25.41) v1(54.97,64.45) v1(55,37.3) v1(55.58,6.82) v1(55.58,4.43) v1(55.89,25.41) v1(56.06,65.32) v1(56.16,10.61) v1(56.42,60.55) v1(56.42,59.61) v1(56.42,58.66) v1(56.53,6.82) v1(56.53,4.43) v1(56.83,25.41) v1(56.92,47.79) v1(57.05,66.16) v1(57.34,10.61) v1(57.53,37) v1(57.87,47.79) v1(58.19,34.61) v1(58.48,37) v1(58.63,4.43) v1(58.81,47.79) v1(59.14,34.61) v1(59.29,60.55) v1(59.29,59.61) v1(59.29,58.66) v1(59.31,25.41) v1(59.43,37) v1(59.59,16.98) v1(59.57,4.43) v1(60.07,39.38) v1(60.09,34.61) v1(60.25,40.1) v1(60.2,33.42) v1(60.26,25.41) v1(60.52,4.43) v1(60.73,16.98) v1(60.78,1.64) v1(61.06,37) v1(61.15,33.42) v1(61.2,25.41) v1(61.24,12.54) v1(61.34,47.89) v1(61.47,74.74) v1(61.73,1.64) v1(62.12,37) v1(62.09,33.42) v1(62.18,12.18) v1(62.29,47.89) v1(62.42,74.74) v1(62.68,1.64) v1(63.24,47.89) v1(63.36,74.74) v1(63.93,4.46) v1(64.06,41.92) v1(64.14,23.51) v1(64.88,4.46) v1(65.18,19.32) v1(65.18,17.14) v1(65.83,4.46) v1(66.12,1.67) v1(67.06,1.67) v1(67.52,17.06) v1(68.01,1.67) v1(68.64,27.06) v1(68.63,4.46) v1(69.19,17.08) v1(69.59,27.06) v1(69.58,4.46) v1(69.83,74.74) v1(70.53,27.06) v1(70.52,4.46) v1(70.77,74.74) v1(71.38,60.33) v1(71.38,59.3) v1(71.45,1.64) v1(71.72,74.74) v1(71.68,11.57) v1(71.94,37.73) v1(71.94,17.08) v1(71.94,16.12) v1(71.99,40.22) v1(71.99,39.05) v1(72.09,59.63) v1(72.21,11.01) v1(72.4,1.64) v1(72.94,40.22) v1(72.94,39.05) v1(72.91,37.73) v1(73.34,1.64) v1(74.53,42.05) v1(74.47,17.49) v1(74.47,16.17) v1(74.65,12.79) v1(74.96,12.13) v1(75.09,41.29) v1(75.82,40.6) v1(75.82,1.67) v1(76.69,12.66) v1(76.77,1.67) v1(76.94,17.52) v1(76.94,16.17) v1(77.07,24.68) v1(77.12,4.46) v1(77.71,1.67) v1(78.06,4.46) v1(78.21,34) v1(78.74,74.74) v1(79.01,4.46) v1(79.56,33.95) v1(79.61,35.02) v1(79.66,17.43) v1(79.66,16.14) v1(79.69,74.74) v1(79.68,24.68) v1(80.63,74.74) v1(80.9,4.46) v1(81,47.55) v1(81,46.6) v1(81,45.66) v1(81.1,52.73) v1(81.1,51.79) v1(81.1,50.84) v1(81.26,35.04) v1(81.26,33.96) v1(81.31,43.12) v1(81.31,1.67) v1(81.85,4.46) v1(81.94,43.75) v1(82.25,1.67) v1(82.79,4.46) v1(83.24,35.03) v1(83.24,33.95) v1(83.2,1.67) v1(83.52,53.21) v1(83.52,52.27) v1(83.52,51.32) v1(84.99,4.46) v1(85.57,1.64) v1(85.94,4.46) v1(86.52,1.64) v1(86.74,35.25) v1(86.74,34.36) v1(86.74,33.49) v1(86.88,4.46) v1(87.47,1.64) v1(89.36,4.49) v1(89.69,74.69) v1(89.94,22.19) v1(89.92,1.64) v1(90.31,4.49) v1(90.64,74.69) v1(90.63,33.96) v1(90.63,33.01) v1(90.63,32.06) v1(90.86,1.64) v1(90.89,22.19) v1(91.25,4.49) v1(91.58,74.69) v1(91.81,1.64) v1(92.53,52.83) v1(92.53,51.88) v1(92.53,50.94) v1(92.48,48.26) v1(92.48,47.31) v1(92.48,46.36) v1(92.81,17.34) v1(93.53,16.63) v1(93.7,4.46) v1(94.65,4.46) v1(94.67,1.64) v1(94.95,22.29) v1(95.02,25.49) v1(95.59,4.46) v1(95.61,1.64) v1(95.79,16.47) v1(95.79,12.63) v1(95.89,22.29) v1(95.97,25.49) v1(96.56,1.64) v1(96.84,22.29) v1(96.91,25.49) v1(97.06,32.91) v1(97.03,30.88) v1(97.16,11.78) v1(97.18,16.47) v1(97.31,74.69) v1(98,32.91) v1(97.98,30.88) v1(98.16,25.44) v1(98.26,74.69) v1(98.26,45.71) v1(98.74,11.78) v1(98.95,32.91) v1(98.92,30.88) v1(99.11,25.44) v1(99.2,74.69) v1(99.77,2.68) v1(100.05,25.44) v1(100.3,11.78) v1(100.61,63.37) v1(100.61,62.43) v1(100.61,61.48) v1(100.59,58.19) v1(100.59,57.25) v1(100.59,56.3) v1(100.71,72.01) v1(100.71,71.06) v1(100.71,70.12) v1(100.72,2.68) v1(101.35,23.95) v1(101.35,23.01) v1(101.35,22.06) v1(101.35,17.58) v1(101.35,16.63) v1(101.35,15.69) v1(101.32,12.83) v1(101.32,11.88) v1(101.32,10.94) v1(101.42,32.93) v1(101.42,30.88) v1(101.66,2.68) v1(102.8,53.95) v1(102.8,53.01) v1(102.8,52.06) v1(102.95,64.29) v1(102.95,63.34) v1(102.95,62.4) v1(102.92,58.32) v1(102.92,57.37) v1(102.92,56.43) v1(104.62,10.39) v1(104.62,9.44) v1(104.62,8.5) v1(104.78,36.26) v1(105.08,61.24) v1(105.08,60.29) v1(105.08,59.35) v1(105.08,58.35) v1(105.08,53.41) v1(105.08,52.27) v1(105.08,51.33) v1(105.08,50.38) v1(105.87,42.19) v1(105.87,41.24) v1(105.87,40.3) v1(106.05,64.29) v1(106.05,63.34) v1(106.05,62.4) v1(107.04,34.1) v1(107.04,33.16) v1(107.04,32.21) v1(107.04,27.32) v1(107.04,26.37) v1(107.04,25.43) v1(108.23,52.3) v1(108.23,51.35) v1(108.23,50.41) v1(108.44,43.35) v1(109.38,43.35) v1(109.43,11.88) v1(109.43,10.93) v1(109.43,9.99) v1(110.33,43.35) v1(112.35,6.53) v1(112.35,5.58) v1(112.35,4.64) v1(113.54,28.46) v1(113.54,27.52) v1(113.54,26.57) v1(113.59,34.15) v1(113.59,33.21) v1(113.59,32.26)
VBUS_FS: length 13.5
  Top Layer w0.508: CN3.A4B9 v4(111.75,41.53) 111.75,40.81 110.31,39.38 D1.1 ; CN3.B4A9 111.78,46.43 v4(111.75,46.41)
  Bottom Layer w0.152: R54.2 111.74,46.42
  Bottom Layer w0.508: v4(111.75,41.53) v4(111.75,46.41) 111.74,46.42
VCC: length 78.1
  Top Layer w0.254: U6.1 11.45,41.47 11.02,41.05 v3(11.02,40.79) 11.76,40.79 11.96,41 U6.48 ; v3(11.45,32.26) 11.45,32.27 U6.36 ; U6.24 6.12,35.5 v3(6.56,35.94) ; U6.9 7.45,41.27 v3(7.14,40.96)
  Top Layer w0.508: J9.1 17.22,44 17.22,53.39 C14.1 ; 15.62,55.02 U7.5
  Bottom Layer w0.254: RP1.4 RP1.3 RP1.2 RP1.1 12.47,42.82 12.43,42.77
  Bottom Layer w0.508: 11.71,43.03 11.71,42.96 12.16,42.51 ; 11.71,43.03 7.31,43.03 6.55,42.27 6.55,39.62 ; 11.71,43.03 12.69,43.03 ; 6.55,41 7.1,41 v3(7.14,40.96) ; 16.25,43.03 12.69,43.03 ; 12.69,43.03 12.43,42.77 12.16,42.51 ; 12.16,42.51 12.16,39.62 ; v3(6.56,35.94) 8.02,35.94 8.02,34.16 9.93,32.26 v3(11.45,32.26) 12.73,32.34 13.5,31.56 P1.1 15.83,33.03 14.75,34.11 14.75,38.76 13.89,39.62 12.16,39.62 ; 12.16,39.62 10.28,39.62 10.28,40.46 10.61,40.79 v3(11.02,40.79)
VCC3.5V: length 12.4
  Top Layer w0.508: 6.27,53.58 6.24,53.61 6.25,58.56
  Top Layer w0.635: 6.24,53.48 6.09,53.33 ; 6.24,53.48 C17.1 ; 6.24,53.48 6.24,53.18 D5.2 ; 6.24,58.57 6.24,53.48
VDD: length 275.1
  Top Layer w0.203: 67.32,43.52 67.32,43.39 U4.1 ; 67.32,43.52 67.33,43.52 ; 67.32,43.52 67.25,43.59 67.25,43.77 67.21,43.81 v1(67.21,44) ; U4.32 77.51,35.81 v1(76.38,36.94) ; U4.64 69.88,45.53 v1(69.08,45.53)
  Top Layer w0.381: v1(69.08,45.53) v1(67.32,45.53) ; J2.1 60.58,8.1 60.58,11.34 59.54,12.38 v1(59.54,15.61)
  Top Layer w0.508: 39.91,57.37 v1(60.53,57.37) ; 39.91,57.37 39.9,57.37 R4.1 38.75,55.68 34.6,51.53 JP1.1 ; 39.91,57.37 JP3.2 42.09,62.09 42.09,66 43.8,67.71 J1.32 ; v1(42.27,6.67) 42.27,5.32 42.7,4.89 43.97,4.89 B2.2 B2.1 51.98,3.66 52.76,2.89 96.85,2.89 99.75,5.78 99.75,8.6 98.99,9.36 97.4,9.36 J2.32
  Bottom Layer w0.381: v1(67.21,44) 66.32,44 C7.1 ; C7.1 66.07,45.63 ; C7.1 65.65,43.74 64.75,42.84 52.5,42.84 51.51,41.86 51.51,23.64 v1(59.54,15.61) ; v1(67.32,45.53) 67.32,46.52 67.08,46.75 R58.1
  Bottom Layer w0.508: v1(60.53,57.37) 60.53,50.31 61.33,49.52 67.43,49.52 C4.1 ; C6.1 75.34,38.9 72.89,41.35 70.13,41.35 L1.1 69.45,42.03 69.45,43.04 69.08,43.41 v1(69.08,45.53) 69.08,47.87 ; v1(42.27,6.67) 42.27,31.51 40.06,33.72 40.06,48.88 39.25,49.7 JP1.1 ; v1(76.38,36.94) 76.04,37.29 75.39,37.29
VDDA: length 37.8
  Top Layer w0.229: 70.68,37.4 68.08,37.4
  Bottom Layer w0.381: C28.2 L1.2 68.51,40.47 68.15,40.83 68.15,47.13 66.65,48.63 60.55,48.63 57.77,51.41 J3.8 ; v1(70.68,37.46) 69.83,37.46 C27.2
  Bottom Layer w0.508: C27.2 C28.2
ATLINK_5V: length 85.9
  Top Layer w0.635: v5(11.81,66.14) 11.83,66.15 ; 11.83,66.15 CN6.A4B9 ; 11.83,66.15 11.83,64.76 F2.1 ; CN6.B4A9 6.92,66.15 v5(6.92,66.14)
  Bottom Layer w0.762: D3.2 13.39,12.26 12.12,13.53 3.41,13.53 1.81,15.12 1.81,64.61 3.35,66.14 v5(6.92,66.14) v5(11.81,66.14) 11.81,65.36 12.38,64.8 TP3.1
ATLK_RX: length 54.4
  Top Layer w0.152: v3(9.68,11.95) v1(9.68,16.78) 9.68,18.25 12.98,21.55 R48.1
  Bottom Layer w0.152: 4.21,1.7 5.5,2.99 5.5,10.57 6.88,11.95 v3(9.68,11.95) ; 34.06,20.07 31.54,20.07 CN2.10 30.08,18.61 25.38,18.61 20.6,13.83 18.27,13.83 15.32,16.78 v1(9.68,16.78)
ATLK_TX: length 52.4
  Top Layer w0.152: 11.1,22.51 11.1,21.75 8.89,19.54 v3(8.89,10.75)
  Bottom Layer w0.152: 6.75,1.7 7.99,2.94 7.99,9.84 v3(8.89,10.75) ; v3(8.87,17.34) 15.42,17.34 18.47,14.29 20.35,14.29 27.26,21.2 30.13,21.2 CN2.8 31.56,22.57 33.97,22.57
BOOT0/PF11: length 142.7
  Top Layer w0.152: 7.34,22.56 7.34,9.57 11.01,5.89 12.05,5.89 13.12,4.83 13.12,2.99 11.83,1.7 ; U4.60 72.01,47.92 69.47,50.46 v1(64.16,50.46) 54.43,50.46 51.44,53.46 40.92,53.46 38.84,51.37 v1(38.84,27.7)
  Bottom Layer w0.152: v3(7.34,19.57) 21.47,19.57 22.74,20.84 22.74,24.02 25.2,26.48 30.33,26.48 CN2.4 v1(38.84,27.7) ; 64.16,50.46 64.16,50.47 64.16,67.51 J1.28 ; R31.2 v1(38.84,48.54)
CC1: length 5.9
  Top Layer w0.152: 10.62,67.81 v5(10.62,67.81) CN6.A5
  Bottom Layer w0.152: R56.1 11.09,67.35 v5(10.62,67.81)
CC2: length 5.9
  Top Layer w0.152: v5(7.93,67.81) 7.62,68.11 CN6.B5
  Bottom Layer w0.152: R57.1 7.47,67.35 v5(7.93,67.81)
EGND: length 97.6
  Top Layer w1.27: C30.2 110.13,67.83 CN1.SH1 115.76,66.96 118.53,64.19 118.53,53.08 ; 118.53,53.08 118.41,52.96 CN1.SH2 ; 118.53,53.08 CN3.16 CN3.15
  Bottom Layer w1.27: CN3.13 CN3.15 CN3.16 ; CN1.SH1 115.68,66.96 118.54,64.1 118.53,64.08 118.53,52.88 ; 118.53,52.88 CN3.16 ; 118.53,52.88 118.45,52.96 CN1.SH2 ; CN3.16 CN3.14
EGND2: length 21.9
  Top Layer w1.27: R55.1 5.05,70.4 CN6.14 ; CN6.13 13.7,70.39 C29.2
  Bottom Layer w1.27: CN6.13 CN6.15 CN6.16 CN6.14
FCC1: length 4.5
  Top Layer w0.152: R17.1 110.37,41.9 111.2,42.73 CN3.A5
FCC2: length 11.6
  Top Layer w0.152: R16.1 109.96,40.38 v4(110.49,40.91) ; CN3.B5 114.81,45.73 115.39,45.15 115.39,42.81 v4(114.96,42.38)
  Bottom Layer w0.152: v4(110.49,40.91) 112.45,40.91 113.92,42.38 v4(114.96,42.38)
FD+: length 28
  Top Layer w0.284: CN1.3 107.52,60.18 107.19,60.18 106.3,59.28 106.3,45.55 R18.2 105.97,45.22 105.97,45.12 ; 105.97,45.12 105.97,45.12 ; 105.97,45.12 106.39,44.7 112.48,44.7 112.51,44.73 CN3.B6 114.52,44.73 114.73,44.52 114.73,43.93 114.54,43.73 CN3.A6
FD-: length 28.2
  Top Layer w0.284: CN3.A7 112.51,44.23 112.48,44.26 107.14,44.26 ; 112.02,44.26 112.02,43.45 112.23,43.23 CN3.B7 ; 107.14,44.26 106.41,44.26 105.96,43.81 105.96,43.63 ; 107.14,44.26 v4(107.14,43.76) ; CN1.2 107.71,59.54 107.18,59.54 106.73,59.1 106.73,46.24 107.14,45.84 v4(107.14,45.38)
  Bottom Layer w0.284: v4(107.14,43.76) 107.14,45.38
LD1: length 10.1
  Top Layer w0.152: 13.52,46.57 7.9,46.57 6.95,45.62 U6.10
LD2: length 12.3
  Top Layer w0.152: 13.52,48.34 7.43,48.34 6.45,47.35 U6.11
LD3: length 14.9
  Top Layer w0.152: 13.51,50.1 13.87,50.1 ; 13.51,50.1 7.06,50.1 5.95,48.99 U6.12 ; 13.51,50.1 13.52,50.11
LD4: length 31.6
  Top Layer w0.152: 13.52,51.88 7.8,51.88 v1(3.48,47.56) ; v3(3.8,33.63) 3.21,34.21 3.21,37.77 3.44,37.99 U6.19
  Bottom Layer w0.152: v1(3.48,47.56) 3.48,47.56 3.48,33.95 v3(3.8,33.63)
M-ATLK_RX: length 12.2
  Top Layer w0.152: U6.31 8.95,32.32 8.26,31.63 8.26,29.6 12.98,24.88 12.98,24.05
M-ATLK_TX: length 11.5
  Top Layer w0.152: U6.30 8.45,32.43 7.85,31.83 7.85,27.92 11.1,24.68 11.1,24.05
M-NRST: length 35.6
  Top Layer w0.152: U6.7 8.42,42.52 ; U6.7 8.45,43.94 9.44,44.93 v5(15.82,44.93) ; U6.7 8.45,41.1 v3(8.42,41.07)
  Bottom Layer w0.152: v5(15.82,44.93) 17.23,44.93 17.77,44.4 17.77,25.88 P1.4 ; 8.42,39.66 8.42,39.65 ; 8.42,39.66 v3(8.42,41.07) ; 8.42,39.66 8.42,39.58 C22.1
M-SWCLK: length 13.2
  Top Layer w0.152: P1.3 17.27,27.93 17.27,29.53 16.56,30.24 13.54,30.24 12.95,30.84 U6.37
M-SWDIO: length 10.1
  Top Layer w0.152: P1.2 10.83,29.02 10.45,29.4 U6.34
M-USB_D+: length 41.1
  Top Layer w0.284: U6.33 9.95,33.15 9.91,33.12 9.91,31.68 9.5,31.27 v3(9.5,30.77) ; 8.13,62.47 8.66,61.94 8.66,54.29 v5(8,53.63)
  Bottom Layer w0.284: v3(9.5,30.77) 9.44,30.71 6.05,30.71 4.6,32.17 4.6,48.74 7.65,51.79 7.65,52.76 8,53.11 v5(8,53.63)
M-USB_D-: length 39.4
  Top Layer w0.284: 9.63,62.47 9.1,61.94 9.1,54.01 8.84,53.75 v5(8.84,53.33) ; v3(8.89,31.36) 9.48,31.94 9.48,33.12 9.45,33.15 U6.32
  Bottom Layer w0.284: v3(8.89,31.36) 8.69,31.15 6.23,31.15 5.04,32.35 5.04,48.56 8.09,51.61 8.09,52.58 v5(8.84,53.33)
M_ATLK_BOOT0: length 10.1
  Top Layer w0.152: U6.27 6.95,25.38 7.34,24.99 7.34,24.11
M_ATLK_NRST: length 10.6
  Top Layer w0.152: U6.28 7.45,25.85 9.22,24.08
M_ATLK_SWCLK: length 10.8
  Top Layer w0.152: 3.58,24.13 3.58,24.88 5.95,27.25 U6.25
M_ATLK_SWDIO: length 10.3
  Top Layer w0.152: U6.26 6.45,26.22 5.46,25.23 5.46,24.13
M_ATLK_SWO: length 13.8
  Top Layer w0.152: U6.13 3.24,41 2.7,40.46 2.7,31.17 3.57,30.3 3.57,29.03
NRST: length 192.5
  Top Layer w0.152: 65.24,18.57 v1(66.93,18.57) 91.61,18.57 ; 65.24,18.57 65.25,18.58 ; 65.24,18.57 39.21,18.57 ; 39.37,9.31 39.32,9.36 39.12,9.36 ; J4.3 68.2,13.1 68.2,8.1 J2.7 ; v3(8,11.24) v3(8,17.95) 8,20.49 9.27,21.76 9.27,22.59 9.22,22.53 ; 39.21,18.57 39.21,18.43 ; 39.21,18.57 39.08,18.56 ; 39.21,18.43 C13.2 39.21,9.45 39.12,9.36 ; 39.21,18.43 39.08,18.56 ; 39.12,9.36 31.12,9.36 ; CN2.7 30.25,21.34 30.25,18.96 30.66,18.56 39.08,18.56 ; v1(91.98,37.28) 97.76,37.28 J7.5 ; v1(65.25,23.67) 64.35,24.57 64.35,39.11 65.64,40.4 67.24,40.4 67.25,40.39 U4.7
  Bottom Layer w0.152: CN2.7 27.9,22.6 19.99,14.7 18.67,14.7 15.42,17.95 v3(8,17.95) ; v1(91.48,18.57) 91.98,19.07 v1(91.98,37.28) ; J4.3 66.91,18.57 66.91,18.58 ; 6.75,4.24 6.75,9.99 v3(8,11.24) ; v1(65.25,23.67) 66.4,23.67 66.93,23.14 v1(66.93,18.57)
PA0: length 68.3
  Top Layer w0.152: v1(73.18,17.94) 57.57,17.94 56.87,17.24 56.87,13.83 56.52,13.48 R5.1 ; v1(73.18,24.68) 70.01,24.68 66.26,28.42 66.26,36.43 66.72,36.89 U4.14 ; J2.14 77.49,12.31 82.61,12.31 J6.1
  Bottom Layer w0.152: v1(73.18,24.68) v1(73.18,17.94) 73.18,13.03 74.53,11.67 J2.14
PA1: length 50.7
  Top Layer w0.152: J2.15 78.31,8.05 78.31,10.48 79.28,11.44 84.29,11.44 J6.2 ; U4.15 66.86,36.39 66.71,36.24 66.71,31.96 74.02,24.65 v1(75.47,24.65)
  Bottom Layer w0.152: v1(75.47,24.65) 75.47,24.32 75.59,24.19 75.59,10.56 75.82,10.33 75.82,8.06 J2.15
PA2: length 85.1
  Top Layer w0.152: v1(89.28,25.26) v1(75.97,25.26) 74.32,25.26 67.41,32.18 67.41,35.89 U4.16
  Bottom Layer w0.152: v1(89.28,25.26) 89.28,56.33 94.85,61.9 J5.2 ; J2.16 77.07,10.45 75.97,11.55 75.97,25.26
PA3: length 85
  Top Layer w0.152: v1(89.85,25.8) v1(77.96,25.8) 74.4,25.8 70.01,30.18 U4.17
  Bottom Layer w0.152: J5.1 97.39,61.85 91.14,55.59 91.14,38.01 89.85,36.72 v1(89.85,25.8) ; v1(77.96,25.8) 77.96,15.67 78.11,15.52 78.11,12.69 78.36,12.43 78.36,8.06 J2.17
PA4: length 42.5
  Top Layer w0.152: J2.20 83.54,10.73 86.12,10.73 J6.3 ; v1(81.44,27.32) 74.81,27.32 71.51,30.61 U4.20
  Bottom Layer w0.152: J2.20 82.12,9.38 82.12,10.38 81.44,11.06 v1(81.44,27.32)
PA5: length 115.5
  Top Layer w0.152: U4.21 72.01,30.81 74.99,27.83 v1(82.02,27.83) v1(94.95,27.83) ; J3.6 62.85,57.34 63.88,56.3 93.45,56.3 93.8,55.95 94.94,55.95 v1(94.95,55.96)
  Bottom Layer w0.152: v1(82.02,27.83) 82.02,11.44 83.34,10.12 83.34,8.16 J2.21 ; v1(94.95,27.83) v1(94.95,55.96)
PA6: length 108.4
  Top Layer w0.152: U4.22 72.51,30.9 75.08,28.34 v1(82.6,28.34) v1(94.39,28.34) ; J3.5 65.39,57.74 66.37,56.76 93.63,56.76 93.83,56.56 v1(94.39,56.56)
  Bottom Layer w0.152: J2.22 84.69,9.84 82.6,11.93 v1(82.6,28.34) ; v1(94.39,28.34) v1(94.39,56.56)
PA7: length 110.7
  Top Layer w0.152: v1(95.56,57.19) 69.14,57.19 67.93,58.4 J3.4 ; U4.23 73.01,31.13 75.32,28.82 v1(83.21,28.82) v1(95.56,28.82)
  Bottom Layer w0.152: v1(95.56,57.19) v1(95.56,28.82) ; J2.23 85.98,8.06 85.98,10.03 83.21,12.79 v1(83.21,28.82)
PA8: length 48.2
  Top Layer w0.152: J5.8 79.61,61.55 80.39,60.77 v1(88.32,60.77) ; U4.41 85.47,39.89 v1(85.65,40.07)
  Bottom Layer w0.152: J1.9 88.52,68.95 88.52,64.24 88.32,64.04 v1(88.32,60.77) 88.32,60.24 85.65,57.57 v1(85.65,40.07)
PA9: length 166
  Top Layer w0.152: J3.1 75.55,64.67 76.53,65.65 86.64,65.65 87.22,66.23 J1.10 ; J8.2 113.82,20.09 v1(84.38,20.09) v1(36.57,20.09) ; v1(86.13,59.1) 96.62,59.1 97.89,57.83 JP2.2 ; U4.42 84.96,40.39 v1(85.02,40.45)
  Bottom Layer w0.152: v1(84.38,20.09) 84.38,20.09 84.38,29.71 85.02,30.34 v1(85.02,40.45) 85.02,57.98 v1(86.13,59.1) 86.13,63.62 87.22,64.71 J1.10 ; R10.1 v1(36.57,20.09)
PA10: length 146.6
  Top Layer w0.152: v1(111.51,20.56) 38.59,20.56 v1(36.57,22.58) ; v1(85.47,59.65) 92.03,59.65 92.31,59.94 J5.3 ; v1(84.46,40.91) 84.44,40.89 U4.43
  Bottom Layer w0.152: R9.1 v1(36.57,22.58) 36.58,22.57 ; J1.11 85.96,68.98 85.96,64.15 85.78,63.97 85.78,59.96 v1(85.47,59.65) 84.46,58.64 v1(84.46,40.91) 84.46,30.6 83.82,29.96 v1(83.82,20.56) ; J8.3 111.51,19.86 v1(111.51,20.56)
PA11: length 30.8
  Top Layer w0.152: 83.38,43.38 83.38,43.36 v1(83.87,42.86) ; 83.42,46.41 v1(83.42,45.15)
  Top Layer w0.284: U4.44 81.39,41.39 84.29,44.29 103.9,44.29 104.46,43.73
  Bottom Layer w0.152: v1(83.87,42.86) 83.42,43.32 v1(83.42,45.15)
PA11_E: length 21.5
  Top Layer w0.152: R32.1 v1(83.42,48.83)
  Bottom Layer w0.152: J1.12 84.68,65.39 83.64,64.35 83.64,59.58 82.5,58.43 82.5,49.75 v1(83.42,48.83)
PA12: length 29.4
  Top Layer w0.152: 83.06,43.74 82.07,44.73 R33.2
  Top Layer w0.284: U4.45 81.21,41.89 84.07,44.74 103.94,44.74 104.42,45.23 R18.1
PA12_E: length 23.8
  Top Layer w0.152: R33.1 v1(82.07,48.83)
  Bottom Layer w0.152: J1.13 83.44,68.95 83.44,65.85 83.24,65.65 83.24,59.78 82.07,58.61 v1(82.07,48.83)
PA13/SWDIO: length 157
  Top Layer w0.152: v1(80.19,53.86) 54.71,53.86 52.99,55.59 40.82,55.59 36.96,51.73 36.96,29.61 36.38,29.02 30.33,29.02 CN2.3 ; 11.83,4.24 5.46,10.61 v3(5.46,20.44) 5.46,20.44 5.46,22.58 ; v4(77.41,42.29) 77.51,42.39 U4.46
  Bottom Layer w0.152: J1.14 82.14,64.58 81.05,63.49 81.05,59.37 80.19,58.51 v1(80.19,53.86) 80.17,53.84 80.17,42.99 79.57,42.39 77.51,42.39 v4(77.41,42.29) ; v3(5.46,20.44) 13.54,20.44 14.05,19.93 20.75,19.93 22.13,21.3 22.13,24.53 25.28,27.68 CN2.3
PA14/SWCLK: length 150.3
  Top Layer w0.152: 9.29,4.24 9.29,5.96 4.75,10.5 v3(4.75,18.96) 4.75,20.64 3.58,21.81 3.58,22.58 ; v1(78.26,48.43) 78.26,47.81 77.51,47.07 U4.49 ; CN2.5 29.17,25.14 30.41,26.38 34.55,26.38 37.52,29.35 37.52,51.48 41.12,55.08 52.63,55.08 54.41,53.3 v1(78.26,53.3)
  Bottom Layer w0.152: CN2.5 25.36,25.14 23.62,23.41 23.62,20.97 21.87,19.22 12.83,19.22 12.58,18.96 v3(4.75,18.96) ; J1.17 78.31,69.01 78.31,63.95 77.85,63.49 77.85,60.69 78.26,60.28 v1(78.26,53.3) v1(78.26,48.43)
PA15: length 31.3
  Top Layer w0.152: v1(77.45,49.09) 77.45,47.93 77.01,47.5 U4.50 ; v1(72.19,58.38) 73.18,59.37 v1(77.45,59.37)
  Bottom Layer w0.152: v1(72.19,58.38) 72.19,57.44 71.47,56.73 R39.2 ; J1.18 77.06,66.59 77.45,66.21 v1(77.45,59.37) v1(77.45,49.09)
PB0: length 43
  Top Layer w0.152: v1(86.39,30.29) 76.02,30.29 74.51,31.8 U4.26 ; J6.4 89.77,11.85 J2.26
  Bottom Layer w0.152: v1(86.39,30.29) 86.39,18.33 88.27,16.45 88.27,12.13 89.77,10.62 J2.26
PB1: length 40.4
  Top Layer w0.152: U4.27 75.01,32.16 76.38,30.8 v1(86.9,30.8)
  Bottom Layer w0.152: J2.27 91.06,8.06 91.06,10.1 88.6,12.56 88.6,16.7 86.9,18.4 v1(86.9,30.8)
PB2: length 37.9
  Top Layer w0.152: v1(87.53,31.31) 76.63,31.31 75.51,32.42 U4.28
  Bottom Layer w0.152: 87.53,31.31 87.53,18.84 90.88,15.48 90.88,13.36 92.31,11.93 J2.28
PB3: length 112.2
  Top Layer w0.152: v1(88.4,58.54) v1(74.15,58.54) ; v1(36.71,25.16) 38.23,26.68 38.23,51.37 41.48,54.62 51.89,54.62 54.41,52.11 v1(74.15,52.11) 74.15,49.51 74.45,49.21 74.45,45.46 U4.55
  Bottom Layer w0.152: v1(74.15,52.11) v1(74.15,58.54) 74.15,59.4 71.96,61.58 71.96,65.34 70.84,66.46 70.84,68.85 J1.23 ; v1(88.4,58.54) 89.77,59.92 J5.4 ; v1(36.71,25.16) 35.57,25.17
PB4: length 39.4
  Top Layer w0.152: U4.56 74.01,49.01 73.45,49.58 v1(73.45,50.25) ; v1(83.03,57.75) 83.03,57.75 v1(73.56,57.75)
  Bottom Layer w0.152: J1.24 69.44,66.57 71.55,64.45 71.55,61.23 73.56,59.22 v1(73.56,57.75) 73.45,57.64 v1(73.45,50.25) ; v1(83.03,57.75) 83.03,58.29 84.69,59.95 J5.6
PB5: length 62.6
  Top Layer w0.152: v1(66.6,51.6) 70.64,51.6 73.51,48.73 U4.57 ; J1.25 68.6,71.95 87.56,71.95 88.52,70.98 88.52,63.94 J5.5
  Bottom Layer w0.152: J1.25 65.61,68.96 65.61,66.69 66.6,65.7 v1(66.6,51.6)
PB6: length 26.5
  Top Layer w0.152: v1(70.39,50.94) 73.01,48.31 U4.58
  Bottom Layer w0.152: J1.26 66.97,67.71 69.17,65.52 69.17,61.13 67.79,59.76 67.79,56.94 68.12,56.62 68.96,56.62 68.96,52.36 v1(70.39,50.94)
PB7: length 35.1
  Top Layer w0.152: v1(61.62,51.07) 69.47,51.07 72.51,48.03 U4.59
  Bottom Layer w0.152: v1(61.62,51.07) 61.62,64.78 63.07,66.23 63.07,68.96 J1.27
PB8: length 117.8
  Top Layer w0.152: U4.61 71.51,47.76 69.4,49.88 v1(68.35,49.88) v1(52.71,49.88) ; v1(68.35,55.08) v1(93.73,55.08)
  Bottom Layer w0.152: v1(93.73,55.08) 93.73,22.04 94.24,21.53 97.34,21.53 98.33,20.54 R36.1 ; v1(68.35,49.88) v1(68.35,55.08) ; v1(52.71,49.88) 52.71,62.63 J3.10 52.69,63.9 57.74,68.95 60.52,68.95 J1.29
PB9: length 116.6
  Top Layer w0.152: U4.62 71.01,47.7 69.42,49.29 55.25,49.29 v1(55.23,49.27) ; v1(92.87,54.4) 55.22,54.4
  Bottom Layer w0.152: J3.9 57.79,65.22 60.56,65.22 61.82,66.48 J1.30 ; v1(92.87,54.4) 93.27,53.99 93.27,21.55 93.78,21.05 95.61,21.05 96.19,20.46 R35.1 ; v1(55.23,49.27) v1(55.23,54.39) 55.23,62.63
PB10: length 81.6
  Top Layer w0.152: v1(88.72,55.62) v1(81.21,55.62) ; U4.29 76.01,32.74 76.93,31.82 88.72,31.82 v1(88.72,31.82)
  Bottom Layer w0.152: J5.7 82.15,59.64 81.21,58.69 v1(81.21,55.62) ; v1(88.72,55.62) v1(88.72,31.82) 88.72,19.83 93.55,15 93.55,12.71 96.09,10.17 96.09,8.05 J2.29
PB11: length 38.7
  Top Layer w0.152: U4.30 76.51,32.76 76.89,32.38 88.08,32.38 v1(88.09,32.37)
  Bottom Layer w0.152: v1(88.09,32.37) 88.09,18.89 91.21,15.76 91.21,13.55 94.85,9.91 J2.30
PB12: length 56.9
  Top Layer w0.152: J7.7 96.61,35.89 U4.33
  Bottom Layer w0.152: J1.1 99.24,68.4 99.24,61.48 96.22,58.46 96.22,36.28 J7.7
PB13: length 51.8
  Top Layer w0.152: U4.34 89.5,36.39 92.92,39.81 J7.3
  Bottom Layer w0.152: J1.2 98.81,66.29 98.81,61.79 91.72,54.7 91.72,43.91 92.64,42.99 v1(92.64,39.51)
PB14: length 46.5
  Top Layer w0.152: v1(90.53,38.32) 89.1,36.89 U4.35
  Bottom Layer w0.152: J1.3 96.12,68.98 96.12,67.1 96.29,66.92 96.29,61.51 90.53,55.74 v1(90.53,38.32)
PB15: length 42.9
  Top Layer w0.152: U4.36 88.61,37.39 v1(89.89,38.67)
  Bottom Layer w0.152: J1.4 95.94,66.62 95.94,61.94 89.89,55.89 v1(89.89,38.67)
PC0: length 71.7
  Top Layer w0.152: U4.8 68,39.91 65.77,39.91 64.75,38.89 64.75,25.1 65.8,24.05 65.8,23.06 v1(65.79,23.04) 99.73,23.04 v1(99.75,23.03)
  Bottom Layer w0.152: v1(99.75,23.03) R37.1 ; v1(65.79,23.04) 65.79,13.28 66.91,12.16 J2.8
PC1: length 64.1
  Top Layer w0.152: v1(93.8,19.52) v1(68.2,19.52) ; v1(68.2,23.59) 67.14,23.59 65.12,25.6 65.12,38.63 65.89,39.39 U4.9
  Bottom Layer w0.152: 94.76,19.52 94.73,19.55 ; 94.76,19.52 94.8,19.48 ; 94.76,19.52 v1(93.8,19.52) ; v1(68.2,23.59) 68.2,8.06 J2.9
PC2: length 80.9
  Top Layer w0.152: U4.10 66.21,38.89 65.49,38.17 65.49,27.45 69.38,23.56 v1(69.95,23.56) 91.34,23.56 v1(91.37,23.54) ; J7.1 97.71,42.41 v1(91.87,42.41)
  Bottom Layer w0.152: v1(69.95,23.56) 70.49,23.03 70.49,10.38 J2.10 ; v1(91.87,42.41) 91.87,37.95 91.37,37.44 v1(91.37,23.54)
PC3: length 80.9
  Top Layer w0.152: v1(70.79,24.07) 70.8,24.07 92.59,24.07 v1(92.61,24.09) ; v1(70.79,24.07) 69.86,24.07 65.87,28.06 65.87,37.57 66.69,38.39 U4.11 ; v1(70.79,24.07) 70.74,24.12 ; J7.4 99.06,38.55 v1(92.6,38.55)
  Bottom Layer w0.152: J2.11 70.79,8.01 v1(70.79,24.07) ; v1(92.6,38.55) 92.6,24.1 v1(92.61,24.09)
PC4: length 56.5
  Top Layer w0.152: v1(100.33,29.33) v1(85.07,29.33) 75.57,29.33 73.52,31.38 73.52,33.89 U4.24
  Bottom Layer w0.152: v1(100.33,29.33) 100.33,34.71 J7.8 ; J2.24 87.23,10.74 85.78,12.19 85.78,17.41 85.07,18.12 v1(85.07,29.33)
PC5: length 39.4
  Top Layer w0.152: v1(85.75,29.81) 75.79,29.81 74.01,31.59 U4.25
  Bottom Layer w0.152: J2.25 88.47,8.11 88.47,10.56 86.24,12.79 86.24,17.66 85.75,18.15 v1(85.75,29.81)
PC6: length 43.3
  Top Layer w0.152: U4.37 87.56,37.89 v1(88.14,38.47)
  Bottom Layer w0.152: v1(88.14,38.47) 88.14,56.07 93.45,61.38 93.45,69.11 J1.5
PC7: length 59.2
  Top Layer w0.152: v1(91.26,60.21) 73.95,60.21 73.01,61.15 J3.2 ; U4.38 87.05,38.39 v1(87.55,38.9)
  Bottom Layer w0.152: J1.6 92.3,66.05 91.26,65.01 v1(91.26,60.21) 91.26,60 87.55,56.29 v1(87.55,38.9)
PC8: length 40.8
  Top Layer w0.152: U4.39 86.56,38.89 v1(87.01,39.35)
  Bottom Layer w0.152: J1.7 89.81,70.25 91.04,69.03 91.04,65.37 90.86,65.19 90.86,61.62 90.41,61.17 90.41,59.74 87.01,56.34 v1(87.01,39.35)
PC9: length 36.6
  Top Layer w0.152: v1(86.46,39.79) 86.09,39.41 79.51,39.41
  Bottom Layer w0.152: v1(86.46,39.79) 86.46,57.55 88.98,60.06 88.98,61.43 88.67,61.74 88.67,63.59 89.76,64.68 J1.8
PC10: length 26.2
  Top Layer w0.152: U4.51 76.51,48.1 v1(76.84,48.43)
  Bottom Layer w0.152: v1(76.84,48.43) 76.84,60.37 77.09,60.62 77.09,65.85 75.82,67.12 75.82,68.95 J1.19
PC11: length 23.5
  Top Layer w0.152: v1(76.02,49.04) 76.01,49.03 U4.52
  Bottom Layer w0.152: v1(76.02,49.04) 76.02,60.42 76.69,61.08 76.69,65.55 J1.20
PC12: length 26.3
  Top Layer w0.152: U4.53 75.51,48.47 v1(75.47,48.52)
  Bottom Layer w0.152: J1.21 73.23,69.01 73.23,67.17 74.4,66 74.4,61.28 75.47,60.21 v1(75.47,48.52)
PC13: length 72.6
  Top Layer w0.152: R6.2 55.2,12.05 55.15,12 55.15,9.95 55.74,9.35 J2.2 ; v1(49.96,48.58) 64.85,48.58 65.51,47.92 65.51,43.68 66.29,42.89 U4.2
  Bottom Layer w0.152: v1(49.96,48.58) 49.96,22.77 57.81,14.92 57.81,12 59.29,10.52 J2.2
PC14: length 57.9
  Bottom Layer w0.152: J2.3 63.1,8.07 63.1,10.07 61.9,11.27 61.09,11.27 59.08,13.27 59.08,15.08 50.75,23.41 50.75,42.89 51.31,43.45 63.76,43.45 64.52,44.21 R24.2
PC14/LEXT_IN: length 10.9
  Top Layer w0.152: 64.49,46.55 R22.1 ; 64.49,46.55 v1(64.49,47.79) ; 64.49,46.55 64.49,43.09 65.19,42.39 U4.3
  Bottom Layer w0.152: R24.1 64.52,47.77 v1(64.49,47.79)
PC15: length 52.1
  Bottom Layer w0.152: 62.08,45.58 51.33,45.58 50.37,44.62 50.37,23.08 58.45,15 58.45,12.74 61.83,9.36
PC15/LEXT_OUT: length 10.2
  Top Layer w0.152: R23.1 v1(63.24,44.19) 63.24,43.74 65.08,41.89 U4.4
  Bottom Layer w0.152: R25.1 62.39,46.7 63.1,46.7 63.24,46.56 v1(63.24,44.19)
PD2: length 23.6
  Top Layer w0.152: 74.95,49.78 74.95,45.48 75.01,45.42 U4.54
  Bottom Layer w0.152: v1(74.92,49.78) 74.92,59.76 74.04,60.64 74.04,65.65 71.99,67.71
PF0: length 13
  Bottom Layer w0.152: J2.5 64.37,6.96 65.64,8.22 65.64,10.28 63.32,12.59 63.32,18.3 R28.2
PF0/HEXT_IN: length 27.6
  Top Layer w0.152: R26.1 62.98,41.03 v1(64.07,41.03) 64.44,41.4 66.79,41.4 66.79,41.4 68.01,41.4 U4.5
  Bottom Layer w0.152: R28.1 63.35,24.09 63.91,24.65 63.91,38.58 64.65,39.31 64.65,40.46 v1(64.07,41.03)
PF1: length 10
  Bottom Layer w0.152: J2.6 64.37,9.96 62.97,11.37 62.97,16.04 61.98,17.03 R29.2
PF1/HEXT_OUT: length 26.7
  Top Layer w0.152: U4.6 68,40.88 65.09,40.88 64.04,39.83 v1(64.04,39.69) R27.1
  Bottom Layer w0.152: v1(64.04,39.69) 63.45,39.11 63.45,24.98 61.98,23.51 R29.1
PF4: length 86.7
  Top Layer w0.152: LED2.2 48.26,46.98 v1(48.25,46.97) ; v1(78.51,26.3) 74.58,26.3 70.51,30.37 U4.18 ; v1(48.25,22.64) 48.25,22.38 48.64,21.99 v1(78.51,21.99)
  Bottom Layer w0.152: J2.18 79.61,11.77 78.51,12.87 v1(78.51,21.99) v1(78.51,26.3) ; v1(48.25,22.64) v1(48.25,46.97)
PF5: length 95.3
  Top Layer w0.152: LED3.2 v1(49.17,50.21) ; U4.19 71.01,30.5 74.7,26.81 v1(80.88,26.81) ; v1(49.17,22.97) 49.61,22.54 v1(80.88,22.54)
  Bottom Layer w0.152: v1(49.17,50.21) v1(49.17,22.97) ; J2.19 80.88,8.09 v1(80.88,22.54) v1(80.88,26.81)
PF6: length 68
  Top Layer w0.152: v1(54.69,52.69) v1(79.63,52.69) ; U4.47 76.44,42.89 ; v1(53.39,50.51) 51.56,52.34 48.26,52.34
  Bottom Layer w0.152: J1.15 80.85,69.01 80.85,64.07 80.6,63.82 80.6,59.76 79.63,58.79 v1(79.63,52.69) 79.63,43.3 79.22,42.89 v1(76.44,42.89) ; v1(53.39,50.51) 54.69,51.81 v1(54.69,52.69)
PF7: length 25.6
  Top Layer w0.152: v1(79.05,47.51) 79.09,47.47 79.09,43.48 79.17,43.39 U4.48
  Bottom Layer w0.152: J1.16 79.6,64.6 78.26,63.26 78.26,61.33 79.07,60.52 79.07,47.54 v1(79.05,47.51)
SWO: length 63.1
  Top Layer w0.152: 9.29,1.7 7.95,3.04 7.95,6.19 3.99,10.15 v3(3.99,17.9) 3.99,20.23 2.72,21.5 2.72,25.16 3.57,26.01 3.57,27.48
  Bottom Layer w0.152: v3(3.99,17.9) 5.11,17.9 5.72,18.51 12.8,18.51 13.11,18.81 22.02,18.81 24.18,20.97 24.18,22.98 25.15,23.94 30.33,23.94 CN2.6 34.06,25.14
USB+: length 18.4
  Top Layer w0.284: 8.66,65.12 8.66,68.53 8.63,68.56 CN6.B6 8.64,69.49 8.64,70.53 8.89,70.78 9.32,70.78 9.62,70.48 CN6.A6 ; 8.66,65.12 8.66,64.42 R11.1 ; 8.66,65.12 v5(8.06,65.12)
  Bottom Layer w0.284: TP3.3 13.98,60.61 10.26,64.33 8.85,64.33 v5(8.06,65.12)
USB-: length 14.1
  Top Layer w0.284: CN6.A7 9.13,68.56 9.09,68.53 9.09,68.17 ; 9.09,68.17 9.11,68.19 9.91,68.19 10.12,68.4 CN6.B7 ; 9.09,68.17 9.09,65.12 ; 9.09,65.12 9.09,64.42 R12.1 ; 9.09,65.12 v5(9.71,65.12)
  Bottom Layer w0.284: v5(9.71,65.12) 10.46,65.12 13.33,62.26 TP3.2
$1N307: length 3.9
  Top Layer w0.152: U6.44 14.76,39 16.25,40.49
$1N334: length 3.5
  Top Layer w0.152: LD4.1 16.15,51.88 v5(16.18,51.91)
  Bottom Layer w0.152: 14.32,50.64 14.92,50.64 v5(16.18,51.91)
$1N335: length 3.1
  Top Layer w0.152: LD3.1 16.15,50.11 v5(16.18,50.08)
  Bottom Layer w0.152: 14.32,49.74 15.85,49.74 v5(16.18,50.08)
$1N336: length 3.2
  Top Layer w0.152: LD2.1 16.17,48.34 v5(16.18,48.35)
  Bottom Layer w0.152: v5(16.18,48.35) 15.69,48.84 14.32,48.84
$1N337: length 3.7
  Top Layer w0.152: LD1.1 v5(16.28,46.57)
  Bottom Layer w0.152: v5(16.28,46.57) 14.91,47.94 14.32,47.94
$1N361: length 18.6
  Top Layer w0.508: 4.36,63.14 4.34,63.12 4.34,61.11 ; 6.24,61.11 6.24,63.14 ; U7.1 15.62,63.19 ; U7.3 13.71,63.15
  Top Layer w0.762: 11.89,63.19 15.62,63.19 ; 4.36,63.14 6.24,63.14
  Bottom Layer w0.762: v5(11.9,61.14) 11.87,61.11 v5(7.05,61.11)
$1N396: length 4.1
  Top Layer w0.635: 4.34,58.57 4.34,57.11 4.71,56.73 4.65,56.67 R51.1
$1N467: length 4.2
  Top Layer w0.508: 11.87,56.8 R43.1 14.06,57.58 13.71,57.93 U7.4
$2N290: length 7.5
  Top Layer w0.508: D2.1 37.81,66.56 C3.1 R1.2 34.66,65.47 U2.5
$2N291: length 4.6
  Top Layer w0.508: U2.4 33.35,63.56 33.74,63.95 34.78,63.95 R2.2
$2N326: length 2.8
  Top Layer w0.254: R3.2 29.96,57.39 LED1.1
$2N337: length 9.4
  Top Layer w0.152: U2.3 30.41,63.56 30.76,63.92 30.76,65.17 30.46,65.47 U2.1
  Top Layer w0.508: F1.2 24.13,65.35 C1.1 C2.1 27.63,65.47 U2.1
$2N360: length 15.1
  Top Layer w0.254: R7.1 R5.2 53.84,12.17 R6.1 53.88,11.98 53.88,10.02 53.26,9.4 B2.3 44.11,9.4 44.05,9.34
$2N488: length 2.3
  Top Layer w0.254: R14.1 44.44,50.21 46.71,50.21
$2N489: length 2.2
  Top Layer w0.254: R13.1 44.47,48.03 LED2.1
$2N490: length 2.3
  Top Layer w0.254: R15.1 44.47,52.34 46.71,52.34
$2N12490: length 11.7
  Top Layer w0.152: v1(105.11,46.42) 105.11,48 JP2.1
  Bottom Layer w0.152: 105.08,46.45 v1(105.11,46.42) R54.1
$3N199: length 5.4
  Bottom Layer w0.152: J6.5 94.85,18.23 94.78,18.31 ; R35.2 94.78,18.31 ; 94.78,18.31 R34.2
$3N200: length 5.7
  Bottom Layer w0.152: R37.2 99.73,18.29 R36.2 98.33,15.32 J6.6
$3N264: length 6.3
  Bottom Layer w0.152: R38.1 70.47,57.84 R39.1 70.47,57.87 J3.3
$4N238: length 4.6
  Top Layer w0.152: C25.2 58.7,41.09 Y2.3 58.7,41.06 R26.2
